# Altium schematic sheet MercurialSDR_BLK.SchDoc: p2020 v1
size A4; Author: RF-Lab; DrawnBy: RF-Lab; Revision: Rev1.0; SheetNumber: 1; SheetTotal: 6; ProjectName: MercurialSDR
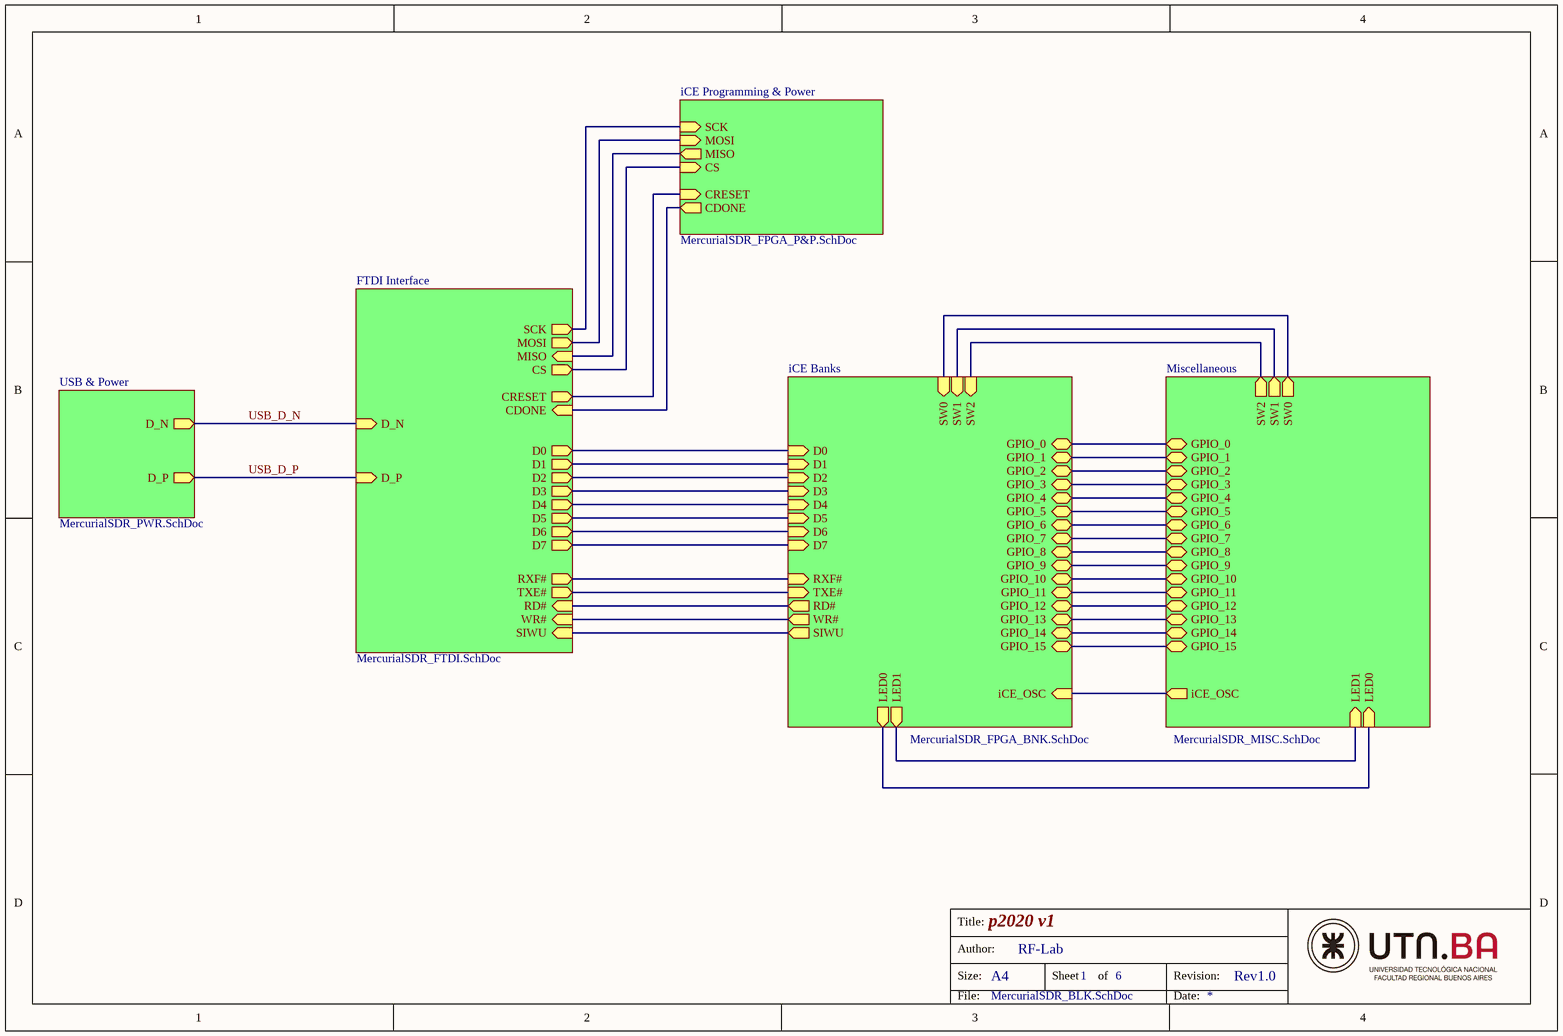
[diagram p0: MercurialSDR_BLK.SchDoc]

## Sub-sheets
FTDI Interface = MercurialSDR_FTDI.SchDoc: SCK (out), MOSI (out), MISO (in), CS (out), CDONE (in), CRESET (out), D0 (out), D1 (out), D2 (out), D3 (out), D4 (out), D5 (out), D6 (out), D7 (out), RXF# (out), TXE# (out), RD# (in), WR# (in), SIWU (in), D_N (in), D_P (in)
iCE Banks = MercurialSDR_FPGA_BNK.SchDoc: LED0 (out), LED1 (out), SW0 (in), SW1 (in), SW2 (in), GPIO_0 (bidir), GPIO_1 (bidir), GPIO_2 (bidir), GPIO_3 (bidir), GPIO_4 (bidir), GPIO_5 (bidir), GPIO_6 (bidir), GPIO_7 (bidir), GPIO_8 (bidir), GPIO_9 (bidir), GPIO_10 (bidir), GPIO_11 (bidir), GPIO_12 (bidir), GPIO_13 (bidir), GPIO_14 (bidir), GPIO_15 (bidir), D3 (in), RXF# (in), D0 (in), TXE# (in), D7 (in), SIWU (out), D2 (in), D6 (in), D1 (in), D4 (in), WR# (out), RD# (out), D5 (in), iCE_OSC (in)
iCE Programming & Power = MercurialSDR_FPGA_P&P.SchDoc: CRESET (in), CDONE (out), CS (in), SCK (in), MOSI (in), MISO (out)
Miscellaneous = MercurialSDR_MISC.SchDoc: SW0 (out), SW1 (out), SW2 (out), LED0 (in), LED1 (in), GPIO_0 (bidir), GPIO_1 (bidir), GPIO_2 (bidir), GPIO_3 (bidir), GPIO_4 (bidir), GPIO_5 (bidir), GPIO_6 (bidir), GPIO_7 (bidir), GPIO_8 (bidir), GPIO_9 (bidir), GPIO_10 (bidir), GPIO_11 (bidir), GPIO_12 (bidir), GPIO_13 (bidir), GPIO_14 (bidir), GPIO_15 (bidir), iCE_OSC (out)
USB & Power = MercurialSDR_PWR.SchDoc: D_N (out), D_P (out)

## Nets
USB_D_N: sheet FTDI Interface/D_N, sheet USB & Power/D_N
USB_D_P: sheet FTDI Interface/D_P, sheet USB & Power/D_P
(unnamed): sheet Miscellaneous/SW0, sheet iCE Banks/SW0
(unnamed): sheet Miscellaneous/SW1, sheet iCE Banks/SW1
(unnamed): sheet Miscellaneous/SW2, sheet iCE Banks/SW2
(unnamed): sheet Miscellaneous/LED0, sheet iCE Banks/LED0
(unnamed): sheet Miscellaneous/LED1, sheet iCE Banks/LED1
(unnamed): sheet Miscellaneous/GPIO_0, sheet iCE Banks/GPIO_0
(unnamed): sheet Miscellaneous/GPIO_1, sheet iCE Banks/GPIO_1
(unnamed): sheet Miscellaneous/GPIO_2, sheet iCE Banks/GPIO_2
(unnamed): sheet Miscellaneous/GPIO_3, sheet iCE Banks/GPIO_3
(unnamed): sheet Miscellaneous/GPIO_4, sheet iCE Banks/GPIO_4
(unnamed): sheet Miscellaneous/GPIO_5, sheet iCE Banks/GPIO_5
(unnamed): sheet Miscellaneous/GPIO_6, sheet iCE Banks/GPIO_6
(unnamed): sheet Miscellaneous/GPIO_7, sheet iCE Banks/GPIO_7
(unnamed): sheet Miscellaneous/GPIO_8, sheet iCE Banks/GPIO_8
(unnamed): sheet Miscellaneous/GPIO_9, sheet iCE Banks/GPIO_9
(unnamed): sheet Miscellaneous/GPIO_10, sheet iCE Banks/GPIO_10
(unnamed): sheet Miscellaneous/GPIO_11, sheet iCE Banks/GPIO_11
(unnamed): sheet Miscellaneous/GPIO_12, sheet iCE Banks/GPIO_12
(unnamed): sheet Miscellaneous/GPIO_13, sheet iCE Banks/GPIO_13
(unnamed): sheet Miscellaneous/GPIO_14, sheet iCE Banks/GPIO_14
(unnamed): sheet Miscellaneous/GPIO_15, sheet iCE Banks/GPIO_15
(unnamed): sheet Miscellaneous/iCE_OSC, sheet iCE Banks/iCE_OSC
(unnamed): sheet iCE Banks/D3, sheet FTDI Interface/D3
(unnamed): sheet iCE Banks/RXF#, sheet FTDI Interface/RXF#
(unnamed): sheet iCE Banks/D0, sheet FTDI Interface/D0
(unnamed): sheet iCE Banks/TXE#, sheet FTDI Interface/TXE#
(unnamed): sheet iCE Banks/D7, sheet FTDI Interface/D7
(unnamed): sheet iCE Banks/SIWU, sheet FTDI Interface/SIWU
(unnamed): sheet iCE Banks/D2, sheet FTDI Interface/D2
(unnamed): sheet iCE Banks/D6, sheet FTDI Interface/D6
(unnamed): sheet iCE Banks/D1, sheet FTDI Interface/D1
(unnamed): sheet iCE Banks/D4, sheet FTDI Interface/D4
(unnamed): sheet iCE Banks/WR#, sheet FTDI Interface/WR#
(unnamed): sheet iCE Banks/RD#, sheet FTDI Interface/RD#
(unnamed): sheet iCE Banks/D5, sheet FTDI Interface/D5
(unnamed): sheet iCE Programming & Power/CRESET, sheet FTDI Interface/CRESET
(unnamed): sheet iCE Programming & Power/CDONE, sheet FTDI Interface/CDONE
(unnamed): sheet iCE Programming & Power/CS, sheet FTDI Interface/CS
(unnamed): sheet iCE Programming & Power/SCK, sheet FTDI Interface/SCK
(unnamed): sheet iCE Programming & Power/MOSI, sheet FTDI Interface/MOSI
(unnamed): sheet iCE Programming & Power/MISO, sheet FTDI Interface/MISO

## Notes on the sheet
- Title:
- Size:
- Author:
- A4
- Sheet
- of
- Revision:
- File:
- Date: